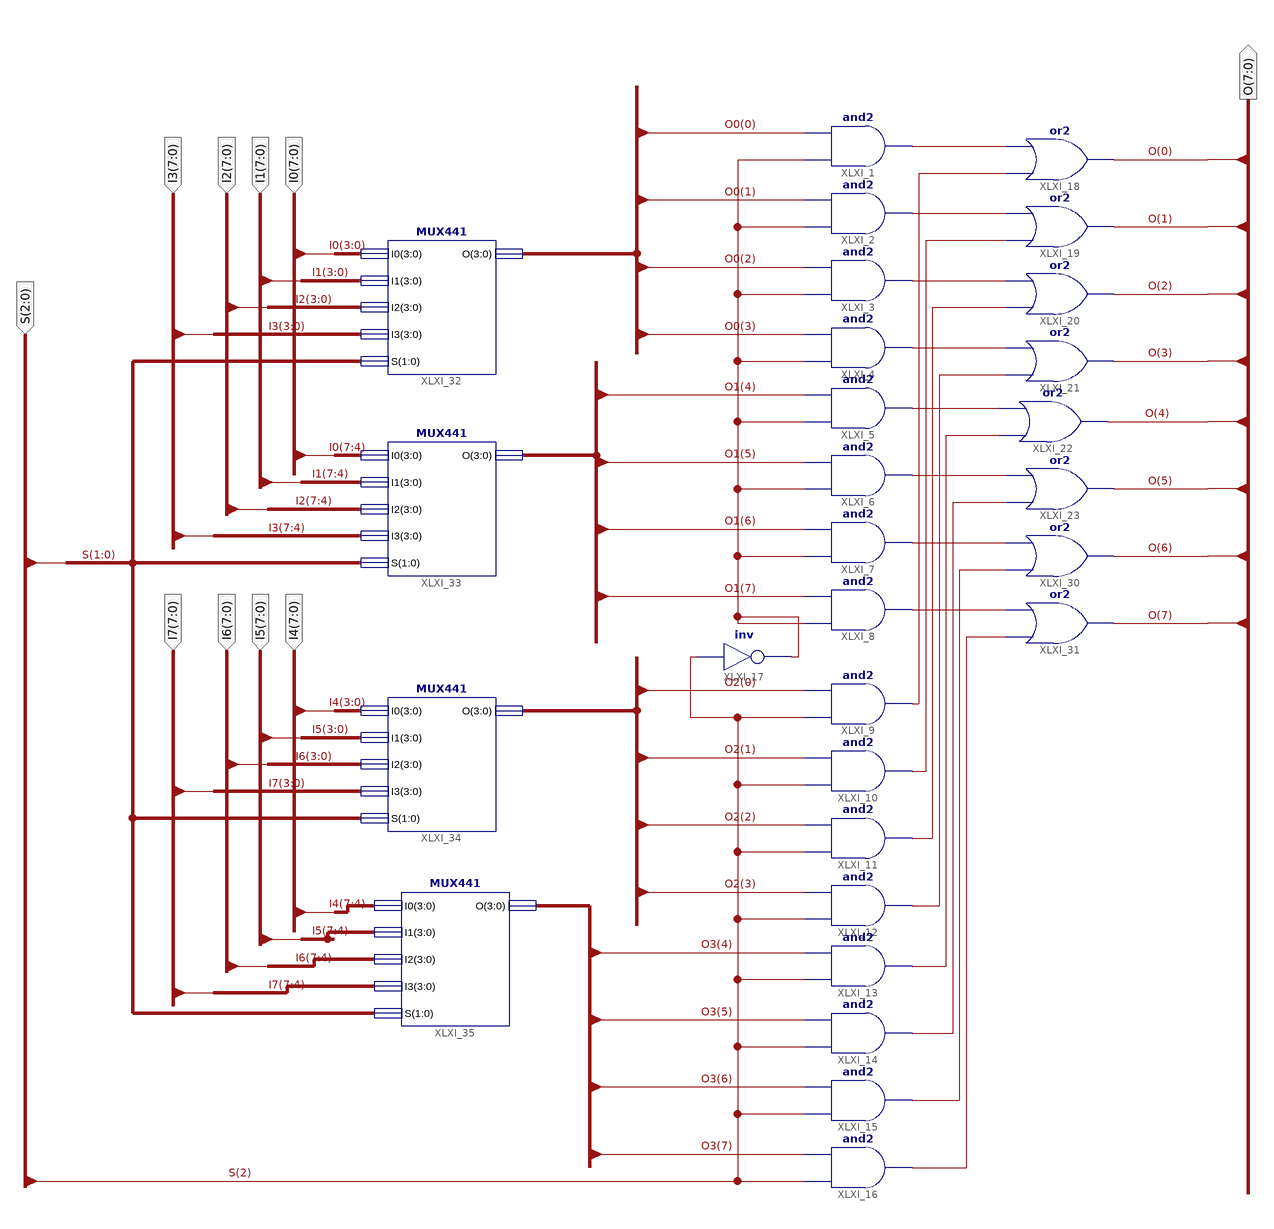
[diagram p0: schematic sheet 1]
// Xilinx ISE schematic MUX8T1_8.sch (kintex7) as structural Verilog: 29 symbols, 10 ports
module MUX8T1_8 (
  input  [2:0] S,
  input  [7:0] I0,
  input  [7:0] I1,
  input  [7:0] I2,
  input  [7:0] I3,
  input  [7:0] I4,
  input  [7:0] I5,
  input  [7:0] I6,
  input  [7:0] I7,
  output [7:0] O
);

  wire XLXN_30, XLXN_107, XLXN_108, XLXN_109, XLXN_110, XLXN_111, XLXN_112, XLXN_113, XLXN_115, XLXN_116,
       XLXN_117, XLXN_118, XLXN_119, XLXN_120, XLXN_121, XLXN_122, XLXN_124;
  wire [3:0] O0, O2;
  wire [7:4] O1, O3;

  and XLXI_1 (XLXN_107, XLXN_30, O0[0]);
  and XLXI_2 (XLXN_108, XLXN_30, O0[1]);
  and XLXI_3 (XLXN_109, XLXN_30, O0[2]);
  and XLXI_4 (XLXN_110, XLXN_30, O0[3]);
  and XLXI_5 (XLXN_111, XLXN_30, O1[4]);
  and XLXI_6 (XLXN_112, XLXN_30, O1[5]);
  and XLXI_7 (XLXN_113, XLXN_30, O1[6]);
  and XLXI_8 (XLXN_115, XLXN_30, O1[7]);
  and XLXI_9 (XLXN_116, S[2], O2[0]);
  and XLXI_10 (XLXN_117, S[2], O2[1]);
  and XLXI_11 (XLXN_118, S[2], O2[2]);
  and XLXI_12 (XLXN_119, S[2], O2[3]);
  and XLXI_13 (XLXN_120, S[2], O3[4]);
  and XLXI_14 (XLXN_121, S[2], O3[5]);
  and XLXI_15 (XLXN_122, S[2], O3[6]);
  and XLXI_16 (XLXN_124, S[2], O3[7]);
  not XLXI_17 (XLXN_30, S[2]);
  or XLXI_18 (O[0], XLXN_116, XLXN_107);
  or XLXI_19 (O[1], XLXN_117, XLXN_108);
  or XLXI_20 (O[2], XLXN_118, XLXN_109);
  or XLXI_21 (O[3], XLXN_119, XLXN_110);
  or XLXI_22 (O[4], XLXN_120, XLXN_111);
  or XLXI_23 (O[5], XLXN_121, XLXN_112);
  or XLXI_30 (O[6], XLXN_122, XLXN_113);
  or XLXI_31 (O[7], XLXN_124, XLXN_115);
  MUX441 XLXI_32 (.I0(I0[3:0]), .I1(I1[3:0]), .I2(I2[3:0]), .I3(I3[3:0]), .S(S[1:0]), .O(O0));
  MUX441 XLXI_33 (.I0(I0[7:4]), .I1(I1[7:4]), .I2(I2[7:4]), .I3(I3[7:4]), .S(S[1:0]), .O(O1));
  MUX441 XLXI_34 (.I0(I4[3:0]), .I1(I5[3:0]), .I2(I6[3:0]), .I3(I7[3:0]), .S(S[1:0]), .O(O2));
  MUX441 XLXI_35 (.I0(I4[7:4]), .I1(I5[7:4]), .I2(I6[7:4]), .I3(I7[7:4]), .S(S[1:0]), .O(O3));
endmodule
